# Altium schematic sheet RV-3032-C7 RTC.SchDoc: RTCMK RTC
size Letter; DocumentNumber: 8; SheetNumber: 8; SheetTotal: 19
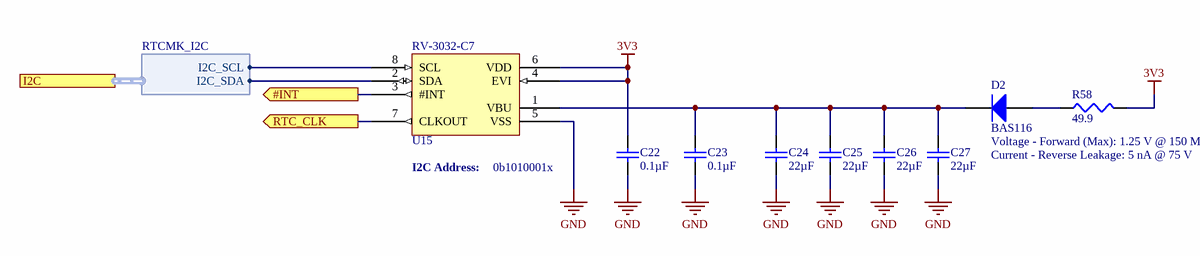
[diagram p0: RV-3032-C7 RTC.SchDoc]

## Parts
C22  value 0.1µF  [TDK-CGA2B]  (hidden comment: Cap)
C23  value 0.1µF  [TDK-CGA2B]  (hidden comment: Cap)
C24  value 22µF  [TY-1206L]  (hidden comment: Cap)
C25  value 22µF  [TY-1206L]  (hidden comment: Cap)
C26  value 22µF  [TY-1206L]  (hidden comment: Cap)
C27  value 22µF  [TY-1206L]  (hidden comment: Cap)
D2  BAS116  Voltage - Forward (Max): 1.25 V @ 150 Ma  Current - Reverse Leakage: 5 nA @ 75 V  [DIOD-DFN1006-2]
R58  value 49.9  [PANA-ERJ2R]  (hidden comment: Res3)
U15  RV-3032-C7  [MCS-RV-3032-C7]

## Ports
#INT (out), I2C (harness RTCMK_I2C), RTC_CLK (out)

## Harnesses
RTCMK_I2C: I2C_SCL, I2C_SDA

## Nets
3V3: C22.1 R58.2 U15.4(EVI) U15.6(VDD)
GND: C22.2 C23.2 C24.1 C25.1 C26.1 C27.1 U15.5(VSS)
#INT: U15.3(#INT) ; port #INT
RTC_CLK: U15.7(CLKOUT) ; port RTC_CLK
NetC23_1: C23.1 C24.2 C25.2 C26.2 C27.2 D2.2(K) U15.1(VBU)
NetD2_1: D2.1(A) R58.1
NetU15_2: U15.2(SDA) ; port I2C.I2C_SDA
NetU15_8: U15.8(SCL) ; port I2C.I2C_SCL

## Notes on the sheet
- (near U15) I2C Address:
- (near U15) 0b1010001x
- (the "License"); you may not use or redistribute this file except in compliance with the License. You
- This file and the information within it are licensed under the terms of the Apache License, Version 2.0
- Copyright
- Unless required by applicable law or agreed to in writing, content distributed under the License is
- distributed on an "AS IS" BASIS, WITHOUT WARRANTIES OR CONDITIONS OF ANY KIND,
- either express or implied. See the License for the specific language governing permissions and
- limitations under the License.
- may obtain a copy of the License at:
- http://www.apache.org/licenses/LICENSE-2.0
- Title
- Size:
- Date:
- Letter
- Number:
- Time:
- Revision:
- Sheet
- of
- University of Alberta
- Deptartment of Electrical
- and Computer Engineering
- Edmonton AB, Canada
- T6G 1H9
- File:

## Library data of the parts
C22 C23 = PC-TDK-02259: CAP CER 0.1UF 50V X7R 0402; Manufacturer Part Number: CGA2B3X7R1H104K050BB; Index: 2259; Designator: C?; Tolerance: ±10%; Published: 2016-03-16; LatestRevisionDate: 2016-03-16; LatestRevisionNote: ...; PackageReference: 0402 (1005 Metric); Publisher: AlbertaSat; PackageDescription: Radial Cap, Thru-Hole; 2 Leads; 0.3 in Pin Spacing; Part Number: PC-TDK-02259; Supplier Part Number 1: 445-6899-1-ND; Supplier 1: Digi-key; Supplier Link: http://www.digikey.ca/product-search/en?keywords=445-6899-1-ND; Voltage - Rated: 50V; Temperature Coefficient: X7R; Applications: Automotive; Operating Temperature: -55°C ~ 125°C
C24-C27 = PC-TY-00721: CAP CER 22UF 16V X7R 1206; Manufacturer Part Number: EMK316BB7226ML-T; Index: 721; Designator: C?; Tolerance: ±20%; Published: 2016-03-13; LatestRevisionDate: 2016-03-13; LatestRevisionNote: ...; PackageReference: 1206 (3216 Metric); Publisher: AlbertaSat; PackageDescription: Chip Capacitor, 2-Leads, Body 3.20x1.60mm, IPC Low Density; Part Number: PC-TY-00721; Supplier Part Number 1: 587-4319-1-ND; Supplier 1: Digi-key; Supplier Link: http://www.digikey.ca/product-search/en?keywords=587-4319-1-ND; Voltage-Rated: 16V; Temperature Coefficient: X7R; Application: General Purpose; Operating Temperature: -55°C ~ 125°C
D2 = 61: DIODE GEN PURP 85V 215MA 2DFN; Part Number: 61; Manufacturer Part Number: BAS116LPH4-7B; Designator: d?; Power - Peak Pulse: 300 mW; Published: 8-Jun-2000; LatestRevisionDate: 17-Jul-2002; LatestRevisionNote: Re-released for DXP Platform.; PackageVersion: Sep-1996; PackageReference: DFN1006; Publisher: Altium Limited; PackageDescription: DO-214-AB/SMC; 2 C-Bend Leads; Body 7.9 x 5.9 mm, inc. leads (LxW); Code_JEDEC: DO-214-AB; Supplier Part Number 1: BAS116LPH4-7BDICT-ND; Supplier 1: Digi-Key; Supplier Part Number 2: 621-BAS116LPH4-7B; Supplier 2: Mouser; Supplier Link: #https://www.digikey.ca/en/products/detail/diodes-incorporated/BAS116LPH4-7B/2755852#; Voltage - Breakdown (Min): 85V; Operating Temperature: -55°C ~ 150°C (TJ)
R58 = 13732: RES SMD 49.9 OHM 1% 1/10W 0402; Part Number: 13732; Manufacturer Part Number: ERJ-2RKF49R9X; Designator: R?; Power: 0.1W, 1/10W; Temperature Coefficient: ±100ppm/°C; Published: 8-Jun-2000; LatestRevisionDate: 29-May-2009; LatestRevisionNote: IPC-7351 Footprint Added.; PackageReference: 0402 (1005 Metric); Publisher: Altium Limited; PackageDescription: Chip Resistor, 2-Leads, Body 1.00x0.50mm, IPC Low Density; Supplier Part Number 1: P49.9LCT-ND; Supplier 1: Digi-Key; Supplier Link: http://www.digikey.ca/product-search/en?keywords=P49.9LCT-ND; Tolerance: ±1%; Operating Temperature: -55°C ~ 155°C
U15 = PU-MCS-00001: Real Time Clock (RTC) IC Clock/Calendar 16B, 32B I²C, 2-Wire Serial 8-WCDFN; Manufacturer Part Number: RV-3032-C7 32.768kHz-2.5PPM-TA-QA; Index: 1; Designator: U?; Time Format: HH:MM:SS:100th (24 hr); Current - Timekeeping (Max): 210nA @ 3V; Voltage - Supply: 1.3V ~ 5.5V; Part Number: PU-MCS-00001; Supplier Part Number 1: 2195-RV-3032-C7-32.768KHZ-2.5PPM-TA-QADKR-ND; Supplier 1: Digi-key; Supplier Part Number 2: 428-203853-MG01; Supplier 2: Mouser; Publisher: AlbertaSat; Published: 2023-04-13; LatestRevisionDate: 2023-04-13; LatestRevisionNote: ...; PackageReference: 8-SON (3.2x1.5); PackageDescription: 8-SON (3.2x1.5); Supplier Link: #https://www.digikey.ca/en/products/detail/micro-crystal-ag/RV-3032-C7-32-768KHZ-2-5PPM-TA-QA/16273065#; Operating Temperature: -40°C ~ 105°C (TA)